# EAGLE schematic throttelPWM5s (EAGLE 9.5.2)
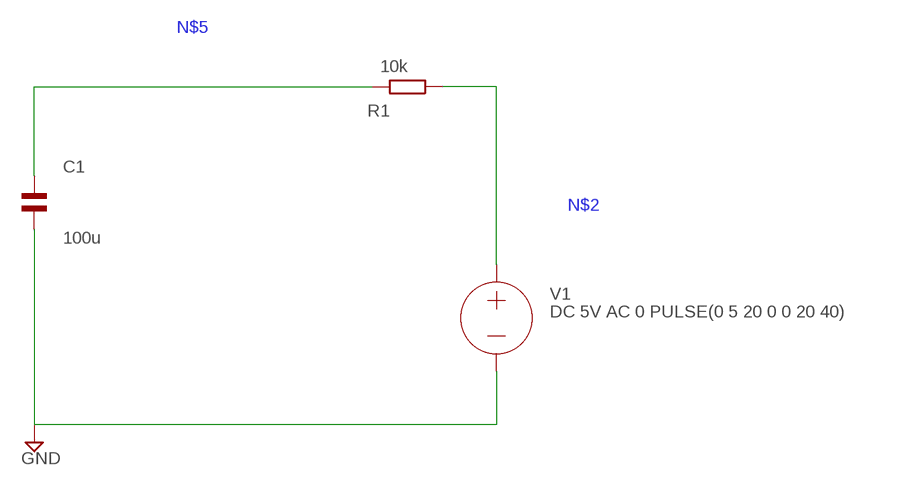
[diagram p0: schematic, sheet 1]

## Parts
C1  100u  EL-BI25-10AXIAL  [EU25-10]
R1  10k  R  (no package)
V1  DC 5V AC 0 PULSE(0 5 20 0 0 20 40)  VOLTAGE  (no package)

## Nets
GND: C1.2 V1.-
N$2: R1.1 V1.+
N$5: C1.1 R1.2

## Library data of the parts
C1 = rcl:EL-: BIPOLAR ELECTROLYTIC CAPACITOR; SPICEPREFIX: C
R1 = ngspice-simulation:R: RESISTOR
V1 = ngspice-simulation:VOLTAGE: Independent Voltage Source, either DC, AC, PULSE, SINE, PWL, EXP, or SFFM; VALUE: 0V